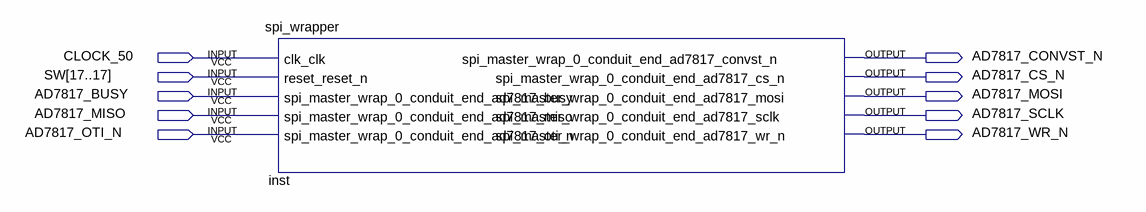
[diagram p0: schematic sheet]
// Quartus schematic ELE113Mandatory2_MS.bdf as structural Verilog: 1 symbols, 10 pins
module ELE113Mandatory2_MS (
  input  CLOCK_50,
  input  [17:17] SW,
  input  AD7817_BUSY,
  input  AD7817_MISO,
  input  AD7817_OTI_N,
  output AD7817_CONVST_N,
  output AD7817_CS_N,
  output AD7817_MOSI,
  output AD7817_SCLK,
  output AD7817_WR_N
);

  spi_wrapper inst (
    .clk_clk(CLOCK_50), .reset_reset_n(SW[17]), .spi_master_wrap_0_conduit_end_ad7817_busy(AD7817_BUSY),
    .spi_master_wrap_0_conduit_end_ad7817_miso(AD7817_MISO),
    .spi_master_wrap_0_conduit_end_ad7817_oti_n(AD7817_OTI_N),
    .spi_master_wrap_0_conduit_end_ad7817_convst_n(AD7817_CONVST_N),
    .spi_master_wrap_0_conduit_end_ad7817_cs_n(AD7817_CS_N),
    .spi_master_wrap_0_conduit_end_ad7817_mosi(AD7817_MOSI),
    .spi_master_wrap_0_conduit_end_ad7817_sclk(AD7817_SCLK),
    .spi_master_wrap_0_conduit_end_ad7817_wr_n(AD7817_WR_N));
endmodule
